# EAGLE design D2D-TOP (EAGLE 9.6.1)
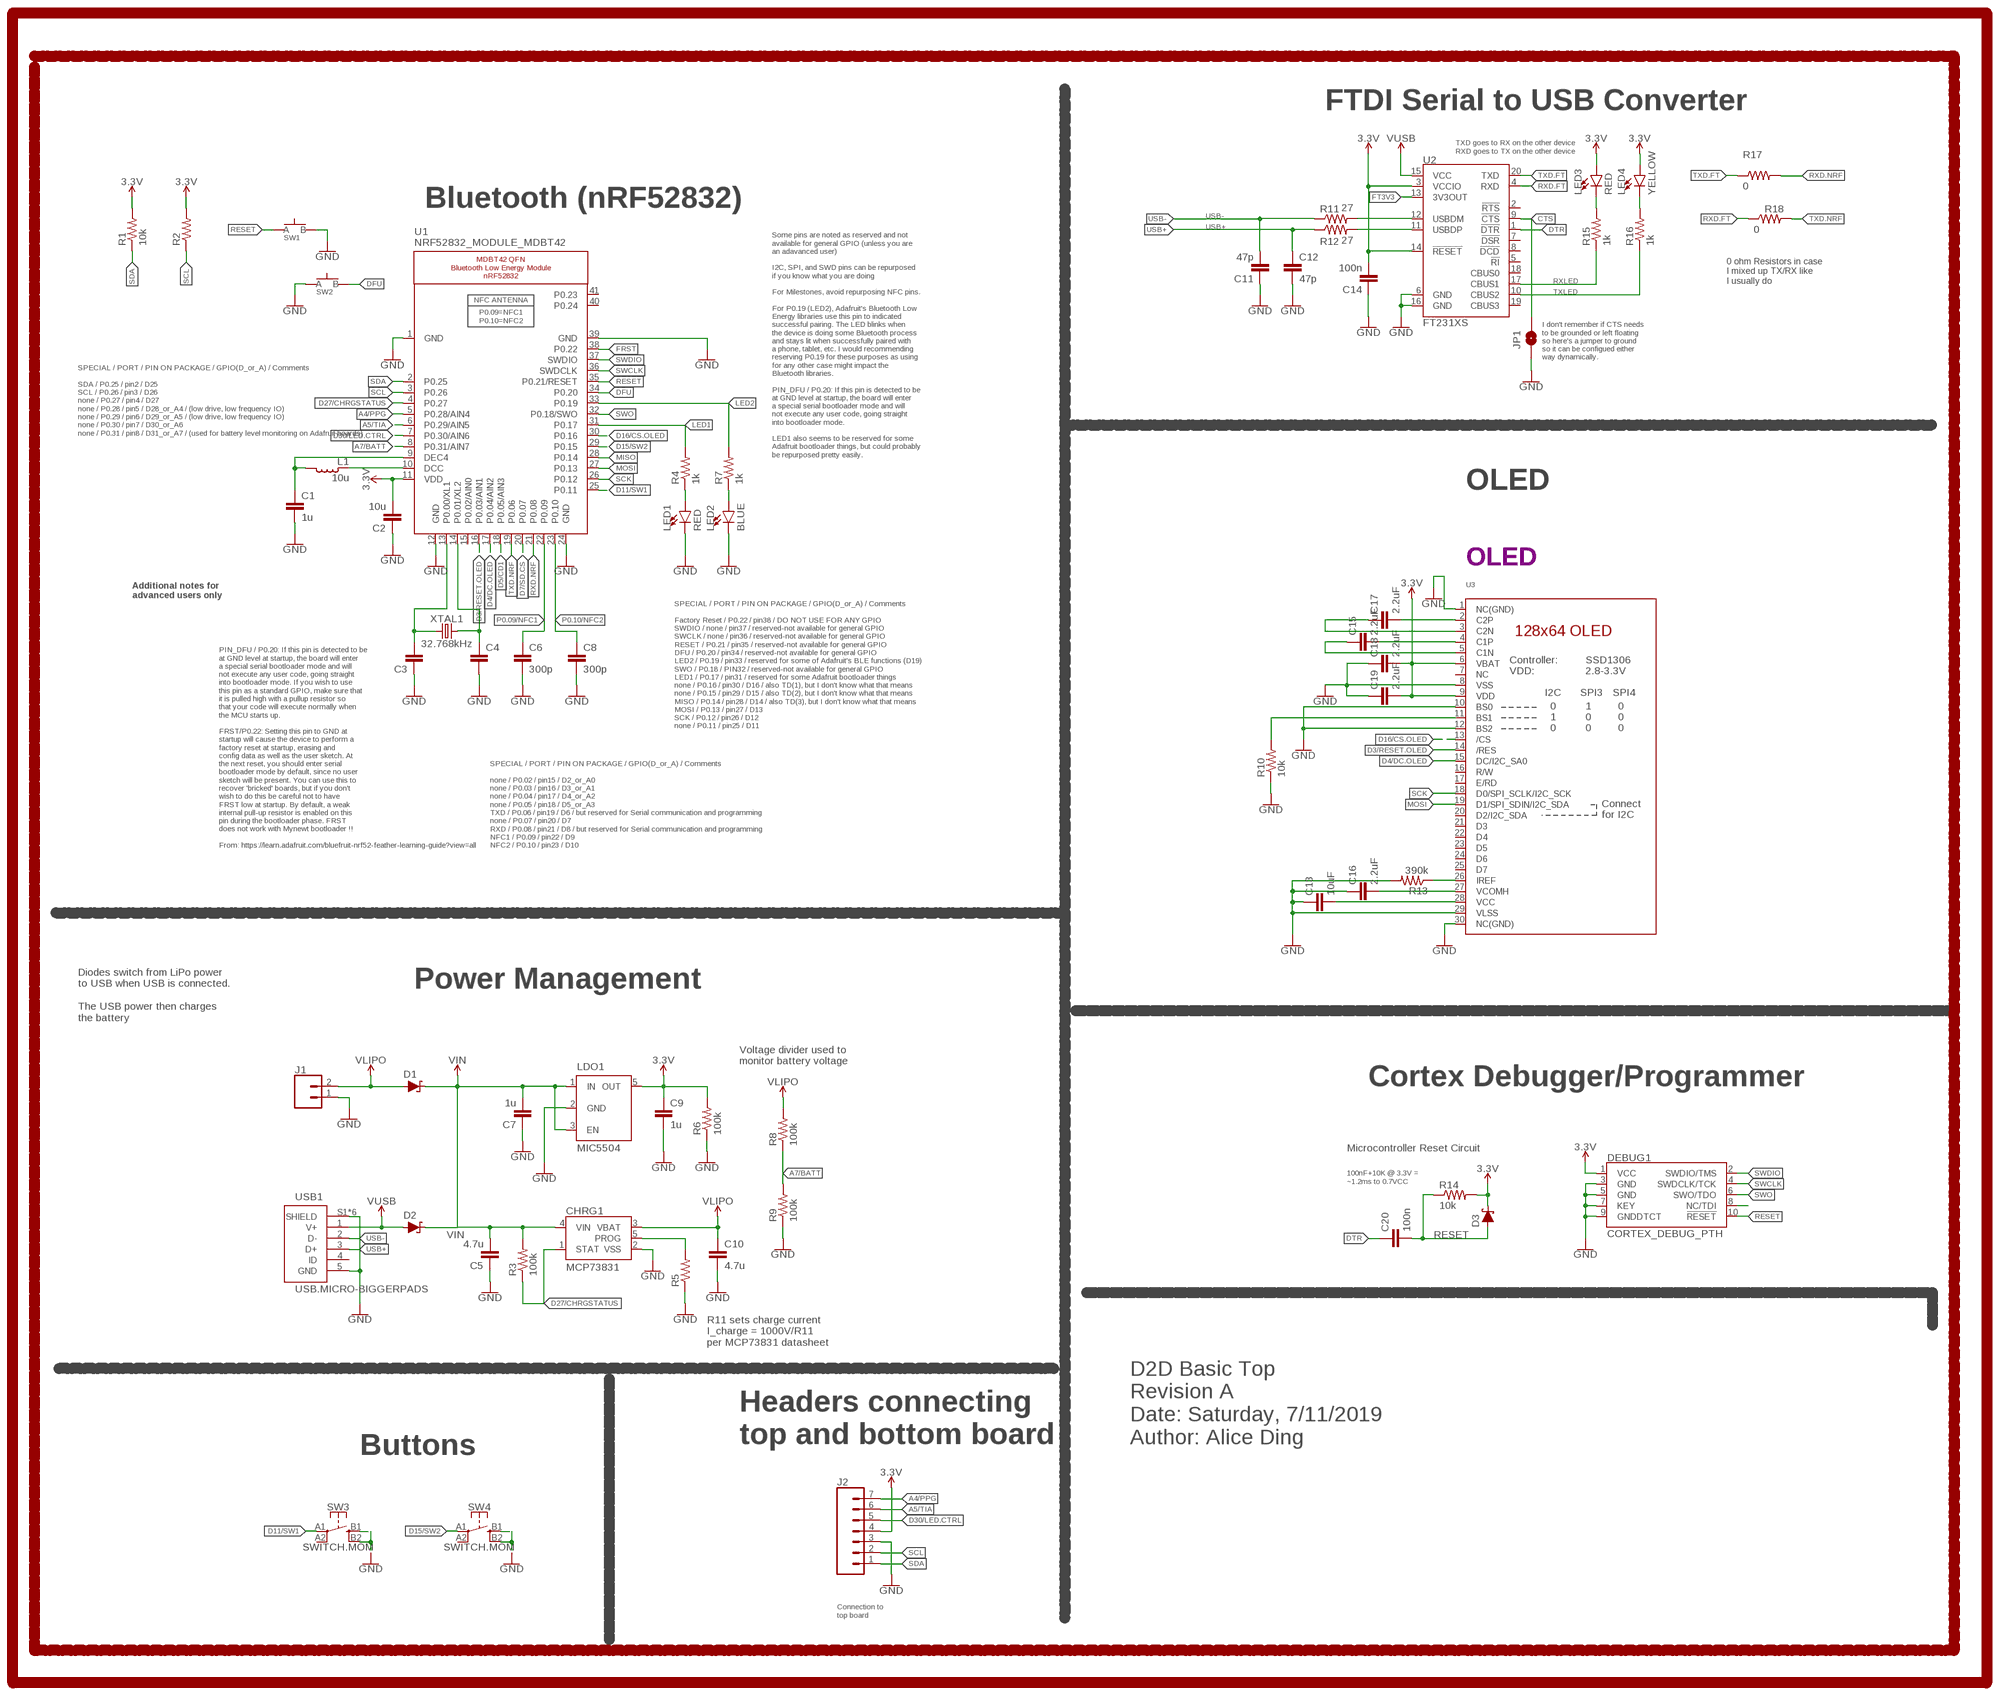
[diagram p0: schematic, sheet 1]

## Parts
C1  1u  CAPACITOR0603  [C0603]
C2  10u  CAPACITOR0805  [C0805]
C3  CAPACITOR0603  [C0603]
C4  CAPACITOR0603  [C0603]
C5  4.7u  CAPACITOR0603  [C0603]
C6  300p  CAPACITOR0603  [C0603]
C7  1u  CAPACITOR0603  [C0603]
C8  300p  CAPACITOR0603  [C0603]
C9  1u  CAPACITOR0603  [C0603]
C10  4.7u  CAPACITOR0603  [C0603]
C11  47p  CAPACITOR0603  [C0603]
C12  47p  CAPACITOR0603  [C0603]
C13  10uF  CAPACITOR0603  [C0603]
C14  100n  CAPACITOR0603  [C0603]
C15  2.2uF  CAPACITOR0402  [C0402]
C16  2.2uF  CAPACITOR0402  [C0402]
C17  2.2uF  CAPACITOR0402  [C0402]
C18  2.2uF  CAPACITOR0402  [C0402]
C19  2.2uF  CAPACITOR0402  [C0402]
C20  100n  CAPACITOR0603  [C0603]
CHRG1  MCP73831  [SOT23-5]
D1  SCHOTTKY-USC  [USC]
D2  SCHOTTKY-USC  [USC]
D3  SCHOTTKY-USC  [USC]
DEBUG1  CORTEX_DEBUG_PTH  [2X5-PTH-1.27MM]
J1  CONN_02  [1X02]
J2  CONN_07-1.27MM  [1X07_1.27MM]
JP1  JUMPER-SMT_2_NO_SILK  [SMT-JUMPER_2_NO_SILK]
L1  10u  INDUCTOR0603  [L0603]
LDO1  MIC5504  [SOT23-5]
LED1  RED  LED0603  [LED-0603]
LED2  BLUE  LED0603  [LED-0603]
LED3  RED  LED0603  [LED-0603]
LED4  YELLOW  LED0603  [LED-0603]
R1  10k  RESISTOR0603  [R0603]
R2  RESISTOR0603  [R0603]
R3  100k  RESISTOR0603  [R0603]
R4  1k  RESISTOR0603  [R0603]
R5  RESISTOR0603  [R0603]
R6  100k  RESISTOR0603  [R0603]
R7  1k  RESISTOR0603  [R0603]
R8  100k  RESISTOR0603  [R0603]
R9  100k  RESISTOR0603  [R0603]
R10  10k  RESISTOR0603  [R0603]
R11  27  RESISTOR0603  [R0603]
R12  27  RESISTOR0603  [R0603]
R13  390k  RESISTOR0603  [R0603]
R14  10k  RESISTOR0603  [R0603]
R15  1k  RESISTOR0603  [R0603]
R16  1k  RESISTOR0603  [R0603]
R17  0  RESISTOR0603  [R0603]
R18  0  RESISTOR0603  [R0603]
SW1  SPST-PTS830GG140-COPY.1-3  [BUTTON-GULLWING]
SW2  SPST-PTS830GG140-COPY.1-3  [BUTTON-GULLWING]
SW3  SWITCH.MOM  [TACTILE_SWITCH_SMD_6.2MM_TALL]
SW4  SWITCH.MOM  [TACTILE_SWITCH_SMD_6.2MM_TALL]
U1  NRF52832_MODULE_MDBT42  [BLE_MODULE_RAYTAC_MDBT42]
U2  FT231XS  [SSOP20_L]
U3  DISP_OLED_UG-2864HSWEG01-NO-WRAPAROUND  [UG-2864HSWEG01_0.96IN_NO-WRAPAROUND]
USB1  USB.MICRO-BIGGERPADS  [USB-MICRO-01.BIGGERPADS]
XTAL1  32.768kHz  CRYSTALECS-.327-12.5-12-C-TR  [2-SMD.NOLEAD.2.0MMTO1.2MM]

## Nets
3.3V: C2.2 C9.1 C14.2 C18.2 C19.2 D3.-(C) DEBUG1.1(VCC) J2.4 LDO1.5(OUT) LED3.A LED4.A R1.2 R2.2 R6.2 R14.2 U1.11(VDD) U2.3(VCCIO) U2.14(!RESET) U3.6(VBAT) U3.9(VDD)
A4/PPG: J2.7 U1.5(P0.28/AIN4)
A5/TIA: J2.6 U1.6(P0.29/AIN5)
A7/BATT: R8.1 R9.2 U1.8(P0.31/AIN7)
CTS: JP1.2 U2.9(!CTS)
D3/RESET.OLED: U1.16(P0.03/AIN1) U3.14(/RES)
D4/DC.OLED: U1.17(P0.04/AIN2) U3.15(DC/I2C_SA0)
D5/CD1: U1.18(P0.05/AIN3)
D7/SD.CS: U1.20(P0.07)
D11/SW1: SW3.A1 U1.25(P0.11)
D15/SW2: SW4.A1 U1.29(P0.15)
D16/CS.OLED: U1.30(P0.16) U3.13(/CS)
D27/CHRGSTATUS: CHRG1.1(STAT) R3.1 U1.4(P0.27)
D30/LED.CTRL: J2.5 U1.7(P0.30/AIN6)
DFU: SW2.3(B) U1.34(P0.20)
DTR: C20.1 U2.1(!DTR)
FRST: U1.38(P0.22)
FT3V3: U2.13(3V3OUT)
GND: C1.2 C2.1 C3.1 C4.2 C5.1 C6.2 C7.1 C8.2 C9.2 C10.2 C11.1 C12.2 C13.1 C14.1 C16.1 C18.1 C19.1 CHRG1.2(VSS) DEBUG1.3(GND) DEBUG1.5(GND) DEBUG1.7(KEY) DEBUG1.9(GNDDTCT) J1.1 J2.3 JP1.1 LDO1.2(GND) LED1.C LED2.C R5.1 R6.1 R9.1 R10.1 R13.2 SW1.3(B) SW2.1(A) SW3.B1 SW3.B2 SW4.B1 SW4.B2 U1.1(GND) U1.12(GND) U1.24(GND) U1.39(GND) U2.6(GND) U2.16(GND) U3.1(NC(GND)) U3.8(VSS) U3.10(BS0) U3.12(BS2) U3.29(VLSS) U3.30(NC(GND)) USB1.5(GND) USB1.S1(SHIELD) USB1.S2(SHIELD) USB1.S3(SHIELD) USB1.S4(SHIELD) USB1.S5(SHIELD) USB1.S6(SHIELD)
LED1: R4.2 U1.31(P0.17)
LED2: R7.2 U1.33(P0.19)
MISO: U1.28(P0.14)
MOSI: U1.27(P0.13) U3.19(D1/SPI_SDIN/I2C_SDA)
N$1: R10.2 U3.11(BS1)
N$2: R13.1 U3.26(IREF)
N$3: C17.2 U3.2(C2P)
N$4: C3.2 U1.13(P0.00/XL1) XTAL1.P$1
N$5: C17.1 U3.3(C2N)
N$6: C4.1 U1.14(P0.01/XL2) XTAL1.P$2
N$7: C15.2 U3.4(C1P)
N$8: C15.1 U3.5(C1N)
N$9: LED1.A R4.1
N$10: LED2.A R7.1
N$11: L1.1 U1.10(DCC)
N$12: C1.1 L1.2 U1.9(DEC4)
N$13: C13.2 U3.28(VCC)
N$14: DEBUG1.8(NC/TDI)
N$15: C16.2 U3.27(VCOMH)
N$16: CHRG1.5(PROG) R5.2
N$23: R11.2 U2.12(USBDM)
N$24: R12.2 U2.11(USBDP)
N$25: LED3.C R15.2
N$26: LED4.C R16.2
P0.09/NFC1: C6.1 U1.22(P0.09)
P0.10/NFC2: C8.1 U1.23(P0.10)
RESET: C20.2 D3.+(A) DEBUG1.10(!RESET) R14.1 SW1.1(A) U1.35(P0.21/RESET)
RXD.FT: R18.1 U2.4(RXD)
RXD.NRF: R17.2 U1.21(P0.08)
RXLED: R15.1 U2.17(CBUS1)
SCK: U1.26(P0.12) U3.18(D0/SPI_SCLK/I2C_SCK)
SCL: J2.2 R2.1 U1.3(P0.26)
SDA: J2.1 R1.1 U1.2(P0.25)
SWCLK: DEBUG1.4(SWDCLK/TCK) U1.36(SWDCLK)
SWDIO: DEBUG1.2(SWDIO/TMS) U1.37(SWDIO)
SWO: DEBUG1.6(SWO/TDO) U1.32(P0.18/SWO)
TXD.FT: R17.1 U2.20(TXD)
TXD.NRF: R18.2 U1.19(P0.06)
TXLED: R16.1 U2.10(CBUS2)
USB+: C12.1 R12.1 USB1.3(D+)
USB-: C11.2 R11.1 USB1.2(D-)
V_USB: D2.+(A) U2.15(VCC) USB1.1(V+) ; supply symbol labelled VUSB
VIN: C5.2 C7.2 CHRG1.4(VIN) D1.-(C) D2.-(C) LDO1.1(IN) LDO1.3(EN) R3.2
VLIPO: C10.1 CHRG1.3(VBAT) D1.+(A) J1.2 R8.2
Unconnected: SW3.A2 SW4.A2 U1.15(P0.02/AIN0) U1.40(P0.24) U1.41(P0.23) U2.2(!RTS) U2.5(!RI) U2.7(!DSR) U2.8(!DCD) U2.18(CBUS0) U2.19(CBUS3) U3.7(NC) U3.16(R/W) U3.17(E/RD) U3.20(D2/I2C_SDA) U3.21(D3) U3.22(D4) U3.23(D5) U3.24(D6) U3.25(D7) USB1.4(ID)

## Notes on the sheet
- FTDI Serial to USB Converter
- TXD goes to RX on the other device
  RXD goes to TX on the other device
- Bluetooth (nRF52832)
- 0 ohm Resistors in case
  I mixed up TX/RX like
  I usually do
- I don't remember if CTS needs
  to be grounded or left floating
  so here's a jumper to ground
  so it can be configued either
  way dynamically.
- SPECIAL / PORT / PIN ON PACKAGE / GPIO(D_or_A) / Comments
  
  SDA / P0.25 / pin2 / D25
  SCL / P0.26 / pin3 / D26
  none / P0.27 / pin4 / D27
  none / P0.28 / pin5 / D28_or_A4 / (low drive, low frequency IO)
  none / P0.29 / pin6 / D29_or_A5 / (low drive, low frequency IO)
  none / P0.30 / pin7 / D30_or_A6
  none / P0.31 / pin8 / D31_or_A7 / (used for battery level monitoring on Adafruit boards)
- Some pins are noted as reserved and not
  available for general GPIO (unless you are
  an adavanced user)
  
  I2C, SPI, and SWD pins can be repurposed
  if you know what you are doing
  
  For Milestones, avoid repurposing NFC pins.
  
  For P0.19 (LED2), Adafruit's Bluetooth Low
  Energy libraries use this pin to indicated
  successful pairing. The LED blinks when
  the device is doing some Bluetooth process
  and stays lit when successfully paired with
  a phone, tablet, etc. I would recommending
  reserving P0.19 for these purposes as using
  for any other case might impact the
  Bluetooth libraries.
  
  PIN_DFU / P0.20: If this pin is detected to be
  at GND level at startup, the board will enter
  a special serial bootloader mode and will
  not execute any user code, going straight
  into bootloader mode.
  
  LED1 also seems to be reserved for some
  Adafruit bootloader things, but could probably
  be repurposed pretty easily.
- OLED
- OLED
- Additional notes for
  advanced users only
- SPECIAL / PORT / PIN ON PACKAGE / GPIO(D_or_A) / Comments
  
  Factory Reset / P0.22 / pin38 / DO NOT USE FOR ANY GPIO
  SWDIO / none / pin37 / reserved-not available for general GPIO
  SWCLK / none / pin36 / reserved-not available for general GPIO
  RESET / P0.21 / pin35 / reserved-not available for general GPIO
  DFU / P0.20 / pin34 / reserved-not available for general GPIO
  LED2 / P0.19 / pin33 / reserved for some of Adafruit's BLE functions (D19)
  SWO / P0.18 / PIN32 / reserved-not available for general GPIO
  LED1 / P0.17 / pin31 / reserved for some Adafruit bootloader things
  none / P0.16 / pin30 / D16 / also TD(1), but I don't know what that means
  none / P0.15 / pin29 / D15 / also TD(2), but I don't know what that means
  MISO / P0.14 / pin28 / D14 / also TD(3), but I don't know what that means
  MOSI / P0.13 / pin27 / D13
  SCK / P0.12 / pin26 / D12
  none / P0.11 / pin25 / D11
- PIN_DFU / P0.20: If this pin is detected to be
  at GND level at startup, the board will enter
  a special serial bootloader mode and will
  not execute any user code, going straight
  into bootloader mode. If you wish to use
  this pin as a standard GPIO, make sure that
  it is pulled high with a pullup resistor so
  that your code will execute normally when
  the MCU starts up.
  
  FRST/P0.22: Setting this pin to GND at
  startup will cause the device to perform a
  factory reset at startup, erasing and
  config data as well as the user sketch. At
  the next reset, you should enter serial
  bootloader mode by default, since no user
  sketch will be present. You can use this to
  recover 'bricked' boards, but if you don't
  wish to do this be careful not to have
  FRST low at startup. By default, a weak
  internal pull-up resistor is enabled on this
  pin during the bootloader phase. FRST
  does not work with Mynewt bootloader !!
  
  From: https://learn.adafruit.com/bluefruit-nrf52-feather-learning-guide?view=all
- SPECIAL / PORT / PIN ON PACKAGE / GPIO(D_or_A) / Comments
  
  none / P0.02 / pin15 / D2_or_A0
  none / P0.03 / pin16 / D3_or_A1
  none / P0.04 / pin17 / D4_or_A2
  none / P0.05 / pin18 / D5_or_A3
  TXD / P0.06 / pin19 / D6 / but reserved for Serial communication and programming
  none / P0.07 / pin20 / D7
  RXD / P0.08 / pin21 / D8 / but reserved for Serial communication and programming
  NFC1 / P0.09 / pin22 / D9
  NFC2 / P0.10 / pin23 / D10
- Power Management
- Diodes switch from LiPo power 
  to USB when USB is connected.
  
  The USB power then charges 
  the battery
- Voltage divider used to 
  monitor battery voltage
- Cortex Debugger/Programmer
- Microcontroller Reset Circuit
- 100nF+10K @ 3.3V =
  ~1.2ms to 0.7VCC
- R11 sets charge current
  I_charge = 1000V/R11
  per MCP73831 datasheet
- Headers connecting
  top and bottom board
- D2D Basic Top
  Revision A
  Date: Saturday, 7/11/2019
  Author: Alice Ding
- Buttons
- Connection to 
  top board

## Library data of the parts
C1-C20 = LinnesLab-Passives:CAPACITOR
CHRG1 = LinnesLab-Power:MCP73831: MCP73831T Li-Ion, Li-Pol Controller Miniature single cell, fully integrated Li-Ion, Li-polymer charge management controller Datasheet <http://ww1.microchip.com/downloads/en/DeviceDoc/20001984g.pdf> SparkFun Products: SparkFun ESP32 Thing <https://www.sparkfun.com/products/13907> SparkFun 9DoF Razor IMU M0 <https://www.sparkfun.com/products/14001>; PROD_ID: IC-09995
D1-D3 = LinnesLab-DiscreteSemi:SCHOTTKY: Schottky diode A Schottky diode is a semiconductor diode which has a low forward voltage drop and a very fast switching action. Example: Digi-Key Part Number: RB161MM-20CT-ND
DEBUG1 = LinnesLab-Connectors:CORTEX_DEBUG: Cortex Debug Connector - 10 pin Supports JTAG debug, Serial Wire debug, and Serial Wire Viewer. PTH and SMD connector options available. General Connector Information <http://infocenter.arm.com/help/topic/com.arm.doc.faqs/attached/13634/cortex_debug_connectors.pdf> Products: PTH Connector <http://www.digikey.com/product-detail/en/cnc-tech/3220-10-0100-00/1175-1627-ND/3883661> -via Digi-Key SparkFun PSoc <https://www.sparkfun.com/products/13229> SparkFun T <https://www.sparkfun.com/products/13810>
J1 = LinnesLab-Connectors:CONN_02: Multi connection point. Often used as Generic Header-pin footprint for 0.1 inch spaced/style header connections On any of the 0.1 inch spaced packages, you can populate with these: Break Away Headers - Straight <https://www.sparkfun.com/products/116> (PRT-00116) Break Away Male Headers - Right Angle <https://www.sparkfun.com/products/553> (PRT-00553) Female Headers <https://www.sparkfun.com/products/115> (PRT-00115) Break Away Headers - Machine Pin <https://www.sparkfun.com/products/117> (PRT-00117) Break Away Female Headers - Swiss Machine Pin <https://www.sparkfun.com/products/743> (PRT-00743) For SCREWTERMINALS and SPRING TERMINALS visit here: Screw Terimnals on SparkFun.com <https://www.sparkfun.com/search/results?term=Screw+Terminals> (5mm/3.5mm/2.54mm spacing) This device is also useful as a general connection point to wire up your design to another part of your project. Our various solder wires solder well into these plated through hole pads. Hook-Up Wire - Assortment (Stranded, 22 AWG) <https://www.sparkfun.com/products/11375> (PRT-11375) Hook-Up Wire - Assortment (Solid Core, 22 AWG) <https://www.sparkfun.com/products/11367> (PRT-11367) View the entire wire category on our website here <https://www.sparkfun.com/categories/141> Special notes: Molex polarized connector foot print use with: PRT-08233 with associated crimp pins and housings. 2.54_SCREWTERM for use with PRT-10571. 3.5mm Screw Terminal footprints for PRT-08084 5mm Screw Terminal footprints for use with PRT-08432
J2 = LinnesLab-Connectors:CONN_07: Multi connection point. Often used as Generic Header-pin footprint for 0.1 inch spaced/style header connections On any of the 0.1 inch spaced packages, you can populate with these: Break Away Headers - Straight <https://www.sparkfun.com/products/116> (PRT-00116) Break Away Male Headers - Right Angle <https://www.sparkfun.com/products/553> (PRT-00553) Female Headers <https://www.sparkfun.com/products/115> (PRT-00115) Break Away Headers - Machine Pin <https://www.sparkfun.com/products/117> (PRT-00117) Break Away Female Headers - Swiss Machine Pin <https://www.sparkfun.com/products/743> (PRT-00743) For SCREWTERMINALS and SPRING TERMINALS visit here: Screw Terimnals on SparkFun.com <https://www.sparkfun.com/search/results?term=Screw+Terminals> (5mm/3.5mm/2.54mm spacing) This device is also useful as a general connection point to wire up your design to another part of your project. Our various solder wires solder well into these plated through hole pads. Hook-Up Wire - Assortment (Stranded, 22 AWG) <https://www.sparkfun.com/products/11375> (PRT-11375) Hook-Up Wire - Assortment (Solid Core, 22 AWG) <https://www.sparkfun.com/products/11367> (PRT-11367) View the entire wire category on our website here <https://www.sparkfun.com/categories/141> Special notes: Molex polarized connector foot print use with SKU : PRT-08231 with associated crimp pins and housings. 1MM SMD Version SKU: PRT-10208 NOTES ON THE VARIANTS LOCK and LOCK_LONGPADS... This footprint was designed to help hold the alignment of a through-hole component (i.e. 6-pin header) while soldering it into place. You may notice that each hole has been shifted either up or down by 0.005 of an inch from it's more standard position (which is a perfectly straight line). This slight alteration caused the pins (the squares in the middle) to touch the edges of the holes. Because they are alternating, it causes a "brace" to hold the component in place. 0.005 has proven to be the perfect amount of "off-center" position when using our standard breakaway headers. Although looks a little odd when you look at the bare footprint, once you have a header in there, the alteration is very hard to notice. Also,if you push a header all the way into place, it is covered up entirely on the bottom side.
JP1 = LinnesLab-Switches:JUMPER-SMT_2_NO: Normally open jumper This jumper has two pads in close proximity to each other. Apply solder to close the connection. Round pads are easier to solder for beginners, but are a lot larger. SparkFun Product that uses the round pads: SparkFun EL Sequencer <https://www.sparkfun.com/products/12781>
L1 = LinnesLab-Passives:INDUCTOR
LDO1 = LinnesLab-Power:MIC5504: MIC5504 Voltage Regulator Output Voltages: 1.0V to 3.3V Input Voltages: 2.5V to 5.5V Link to Datasheet http://ww1.microchip.com/downloads/en/DeviceDoc/MIC550X.pdf
LED1-LED4 = LinnesLab-LED:LED: LED (Generic) Standard schematic elements and footprints for 5mm, 3mm, 1206, and 0603 sized LEDs. Generic LEDs with no color specified. LTST-C190KGKT: arrow indicates cathode
R1-R18 = LinnesLab-Passives:RESISTOR
SW1 SW2 = LinnesLab-Switches:SPST-PTS830GG140-COPY
SW3 SW4 = LinnesLab-Switches:SWITCH.MOM: PTS645SM43SMTR92 LFS
U1 = LinnesLab-Microcontrollers:NRF52832_MODULE_MDBT42: MDBT42 - BLE Module (nRF52832 QFN) VDD: 1.7-3.6V
U2 = LinnesLab-DigitalIC:FT231X: FTDI FT231X Full Speed USB to Full-handshake UART This USB2.0 Full Speed IC offers a compact bridge to full handshake UART interfaces. The device is a UART, capable of operating up to 3MBaud, with low power consumption (8mA). The FT231X includes the complete FT-X series feature set and enables USB to be added into a system design quickly and easily over a UART interface. Datasheet <http://cdn.sparkfun.com/datasheets/Components/General%20IC/DS_FT231X.pdf>; DIGIKEY: 768-1156-5-ND; MFN: FT231XS-U
U3 = LinnesLab-Displays:DISP_OLED_UG-2864HSWEG01: UG-2864HSWEG01 OLED display Both 1.3" and 0.96" models share the same FPC tab footprint, only the screen dimensions vary.
USB1 = LinnesLab-Connectors:USB.MICRO: DigiKey PN: 609-4613-1-ND
XTAL1 = LinnesLab-Clocks:CRYSTAL; DIGIKEY: XC2288CT-ND; FREQ: 32.7680KHZ; LOAD_CAP: 12.5pF

## Board
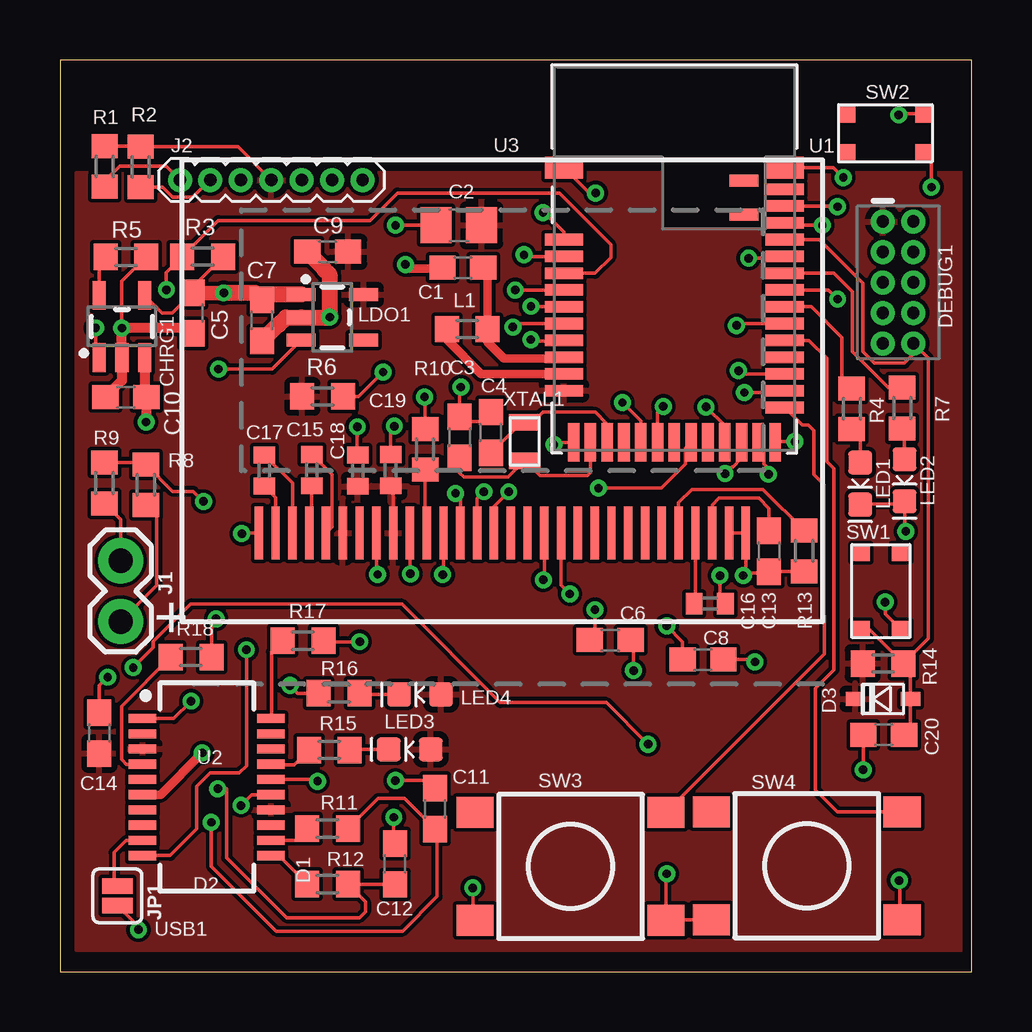
[diagram p1: board, top side]
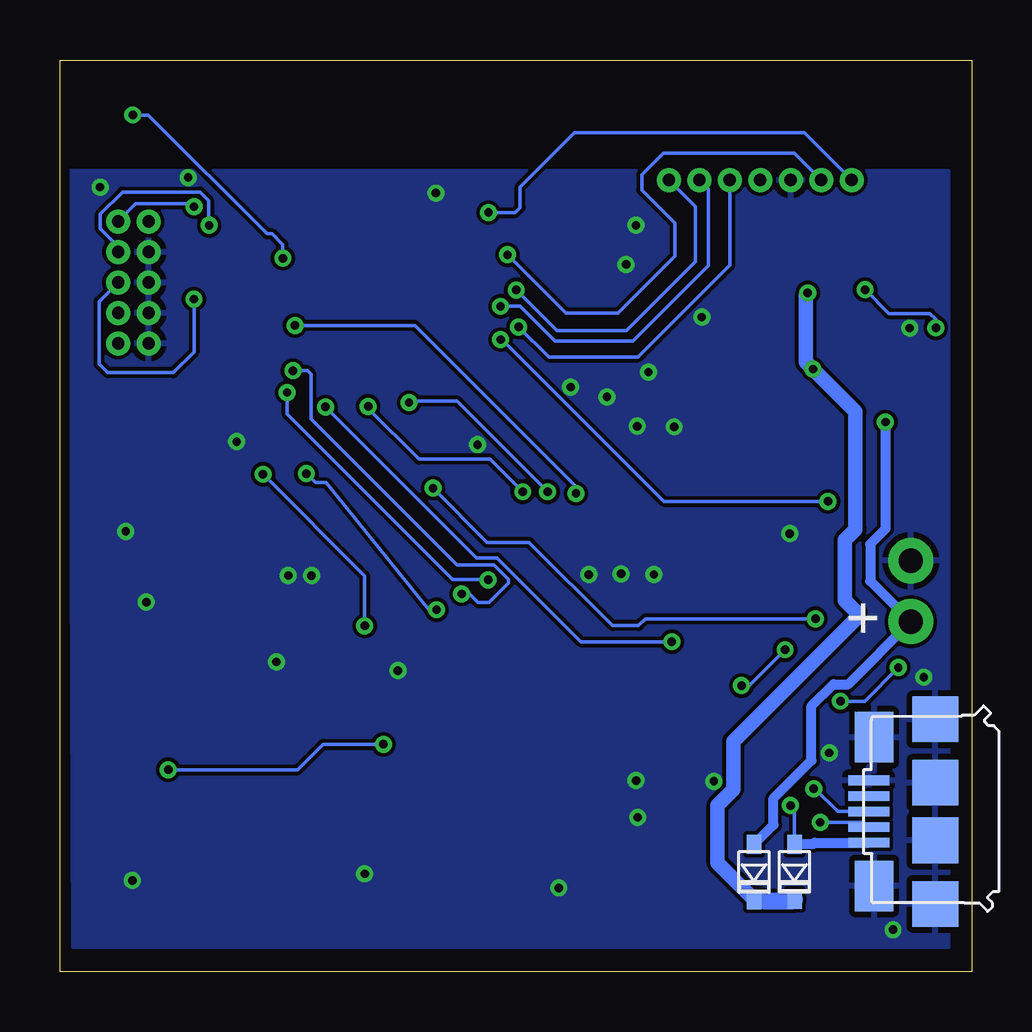
[diagram p2: board, bottom side, seen from below]

Size 38 x 38 mm. Coordinates in mm from the lower left corner, seen from the top.
Outline: 0,0 38,0 38,38 0,38 0,0
Copper layers (1*16): Top 0.0356mm / dielectric 1.5011mm / Bottom 0.0356mm
Design rules "LaenPCBOrder": minimum track width 6mil, minimum drill 13mil, track to track 6mil, track to pad 6mil, pad to pad 6mil, via to via 6mil, smd to smd 6mil, copper to edge 15mil, drill to drill 6mil, minimum pad ring 7mil, minimum via ring 7mil, stop-mask expansion 3mil, vias tented up to drill 0mil, thermal gap 10mil

### Footprints (pad centres in the part's own frame; a part is rotated, then mirrored left to right if it is on the bottom)
C0603 = smd 1.1 x 1: 1 -0.85,0; 2 0.85,0
C0805 = smd 1.3 x 1.5: 1 -0.95,0; 2 0.95,0
C0402 = smd 0.7 x 0.9: 1 -0.65,0; 2 0.65,0
SOT23-5 = smd 0.55 x 1.2: 1 -0.95,-1.3; 2 0,-1.3; 3 0.95,-1.3; 4 0.95,1.3; 5 -0.95,1.3
USC = smd 0.8 x 0.6: + -1.15,0; - 1.15,0
2X5-PTH-1.27MM = drill 0.508 pad 1: 1 -2.54,-0.635; 2 -2.54,0.635; 3 -1.27,-0.635; 4 -1.27,0.635; 5 0,-0.635; 6 0,0.635; 7 1.27,-0.635; 8 1.27,0.635; 9 2.54,-0.635; 10 2.54,0.635
1X02 = drill 1.016 pad 1.88: 1 0,0; 2 2.54,0
1X07_1.27MM = drill 0.508 pad 1: 1 0,0; 2 1.27,0; 3 2.54,0; 4 3.81,0; 5 5.08,0; 6 6.35,0; 7 7.62,0
SMT-JUMPER_2_NO_SILK = smd 0.635 x 1.27: 1 -0.406,0; 2 0.406,0
L0603 = smd 1 x 1.1: 1 -0.85,0; 2 0.85,0
LED-0603 = smd 1 x 1: A -0.877,0; C 0.877,0
R0603 = smd 1 x 1.1: 1 -0.85,0; 2 0.85,0
BUTTON-GULLWING = smd 0.7 x 0.75: 1 -1.6,0.825; 2 1.6,0.825; 3 -1.6,-0.825; 4 1.6,-0.825
TACTILE_SWITCH_SMD_6.2MM_TALL = smd 1.55 x 1.3: A1 -3.975,-2.25; A2 3.975,-2.25; B1 -3.975,2.25; B2 3.975,2.25
BLE_MODULE_RAYTAC_MDBT42 = smd 1.6 x 0.9: 1 -4.6,3.8; 39 4.6,3.8 | smd 1.6 x 0.48: 2 -4.6,0.8; 3 -4.6,0.1; 4 -4.6,-0.6; 5 -4.6,-1.3; 6 -4.6,-2; 7 -4.6,-2.7; 8 -4.6,-3.4; 9 -4.6,-4.1; 10 -4.6,-4.8; 11 -4.6,-5.5; 25 4.6,-6.2; 26 4.6,-5.5; 27 4.6,-4.8; 28 4.6,-4.1; 29 4.6,-3.4; 30 4.6,-2.7; 31 4.6,-2; 32 4.6,-1.3; 33 4.6,-0.6; 34 4.6,0.1; 35 4.6,0.8; 36 4.6,1.5; 37 4.6,2.2; 38 4.6,2.9 | smd 0.48 x 1.6: 12 -4.2,-7.65; 13 -3.5,-7.65; 14 -2.8,-7.65; 15 -2.1,-7.65; 16 -1.4,-7.65; 17 -0.7,-7.65; 18 0,-7.65; 19 0.7,-7.65; 20 1.4,-7.65; 21 2.1,-7.65; 22 2.8,-7.65; 23 3.5,-7.65; 24 4.2,-7.65 | smd 1.2 x 0.5: 40 2.9,3.25; 41 2.9,1.85
SSOP20_L = smd 0.381 x 1.143: 1 -2.857,-2.68; 2 -2.223,-2.68; 3 -1.587,-2.68; 4 -0.953,-2.68; 5 -0.318,-2.68; 6 0.318,-2.68; 7 0.953,-2.68; 8 1.587,-2.68; 9 2.223,-2.68; 10 2.857,-2.68; 11 2.857,2.68; 12 2.223,2.68; 13 1.587,2.68; 14 0.953,2.68; 15 0.318,2.68; 16 -0.318,2.68; 17 -0.953,2.68; 18 -1.587,2.68; 19 -2.223,2.68; 20 -2.857,2.68
UG-2864HSWEG01_0.96IN_NO-WRAPAROUND = smd 0.35 x 2.2: 1 -10.15,-1.2; 2 -9.45,-1.2; 3 -8.75,-1.2; 4 -8.05,-1.2; 5 -7.35,-1.2; 6 -6.65,-1.2; 7 -5.95,-1.2; 8 -5.25,-1.2; 9 -4.55,-1.2; 10 -3.85,-1.2; 11 -3.15,-1.2; 12 -2.45,-1.2; 13 -1.75,-1.2; 14 -1.05,-1.2; 15 -0.35,-1.2; 16 0.35,-1.2; 17 1.05,-1.2; 18 1.75,-1.2; 19 2.45,-1.2; 20 3.15,-1.2; 21 3.85,-1.2; 22 4.55,-1.2; 23 5.25,-1.2; 24 5.95,-1.2; 25 6.65,-1.2; 26 7.35,-1.2; 27 8.05,-1.2; 28 8.75,-1.2; 29 9.45,-1.2; 30 10.15,-1.2
USB-MICRO-01.BIGGERPADS = smd 0.4 x 1.7: 1 -1.3,1.505; 2 -0.65,1.505; 3 0,1.505; 4 0.65,1.505; 5 1.3,1.505 | smd 1.9 x 1.9: S1 -3.85,-1.27; S2 -1.2,-1.27; S3 1.2,-1.27; S4 3.85,-1.27 | smd 2.1 x 1.6: S5 -3.1,1.28; S6 3.1,1.28
2-SMD.NOLEAD.2.0MMTO1.2MM = smd 0.7 x 1.3: P$1 -0.8,0; P$2 0.8,0

### Placement (x,y rotation side)
C1  16.8,29.34 180 top
C2  16.62,31.1 0 top
C3  16.66,22.27 270 top
C4  17.97,22.47 90 top
C5  5.53,27.45 90 top
C6  22.94,13.81 0 top
C7  8.42,27.15 90 top
C8  26.81,13 0 top
C9  11.16,30.01 180 top
C10  2.75,23.95 180 top
C11  15.63,6.79 270 top
C12  13.97,4.49 90 top
C13  29.56,17.52 90 top
C14  1.64,9.94 270 top
C15  10.5,20.9 270 top
C16  27.09,15.34 180 top
C17  8.52,20.89 270 top
C18  12.41,20.88 270 top
C19  13.78,20.9 270 top
C20  34.34,9.87 0 top
CHRG1  2.58,26.89 0 top
D1  9.07,4.15 270 bottom
D2  7.38,4.16 270 bottom
D3  34.31,11.36 180 top
DEBUG1  34.94,28.73 270 top
J1  2.53,17.13 270 top
J2  5,33 0 top
JP1  2.39,3.16 90 top
L1  16.98,26.78 0 top
LDO1  11.35,27.27 270 top
LED1  33.36,20.34 270 top
LED2  35.21,20.48 270 top
LED3  14.58,9.26 180 top
LED4  15.01,11.55 180 top
R1  1.86,33.56 90 top
R2  3.37,33.54 90 top
R3  5.94,29.8 0 top
R4  33,23.46 90 top
R5  2.75,29.79 180 top
R6  10.95,23.98 180 top
R7  35.11,23.49 90 top
R8  3.58,20.29 270 top
R9  1.85,20.36 90 top
R10  15.22,21.77 270 top
R11  11.15,5.96 180 top
R12  11.15,3.65 180 top
R13  31.02,17.54 270 top
R14  34.32,12.84 180 top
R15  11.23,9.24 0 top
R16  11.63,11.6 0 top
R17  10.13,13.79 0 top
R18  5.46,13.11 0 top
SW1  34.22,15.86 90 top
SW2  34.41,34.95 180 top
SW3  21.28,4.38 180 top
SW4  31.13,4.41 180 top
U1  25.61,29.71 0 top
U2  6.12,7.69 270 top
U3  18.44,19.48 0 top
USB1  2.78,6.67 90 bottom
XTAL1  19.38,22.1 90 top

### Tracks (layer width: path | path; a pad name or v marks a point on that pad's centre or on a via)
3.3V
  Top 0.152: C19.2 13.89,20.14 U3.9 | R1.2 3.34,34.41 R2.2 7.42,34.39 J2.4
  pour Top: 37.62,33.31 0.68,33.31 0.68,0.88 37.62,0.88
A4/PPG  (via drill 0.35)
  Top 0.152: v18.98,28.41 U1.5
  Bottom 0.152: J2.7 11.51,31.89 11.51,29.6 14.39,26.72 17.29,26.72 v18.98,28.41
A5/TIA  (via drill 0.35)
  Top 0.152: U1.6 19.66,27.71 v19.64,27.73
  Bottom 0.152: J2.6 10.97,32.62 10.97,29.43 14.12,26.27 17.36,26.27 18.82,27.73 v19.64,27.73
A7/BATT  (via drill 0.35)
  Top 0.152: R9.2 3.51,21.21 R8.1 4.71,20.02 5.56,20.02 v5.98,19.6 | U1.8 20.98,26.28 19.69,26.28 v19.63,26.34
  Bottom 0.152: v19.63,26.34 19.62,26.33 19.55,26.33 12.82,19.6 v5.98,19.6
CTS
  Top 0.152: U2.9 2.75,5.47 2.25,4.97 2.25,3.7 JP1.2
D3/RESET.OLED  (via drill 0.35)
  Top 0.152: U3.14 17.39,19.72 v17.67,20 | v23.45,23.72 24.21,22.96 U1.16
  Bottom 0.152: v17.67,20 21.45,23.78 23.39,23.78 v23.45,23.72
D4/DC.OLED  (via drill 0.35)
  Top 0.152: U3.15 18.09,19.38 v18.71,20 | v25.15,23.56 25.12,23.53 25.12,23.51 24.91,23.3 U1.17
  Bottom 0.152: v18.71,20 20.07,21.36 23.04,21.36 25.15,23.48 v25.15,23.56
D11/SW1
  Top 0.152: U1.25 30.94,22.78 31.19,22.78 31.43,22.54 31.43,20.72 31.85,20.3 31.85,14.83 31.86,14.81 31.86,13.24 SW3.A1
D15/SW2
  Top 0.152: U1.29 31.22,26.31 31.97,25.57 31.97,21.27 32.27,20.97 32.27,12.58 31.49,11.8 31.49,7.57 32.4,6.66 SW4.A1
D16/CS.OLED  (via drill 0.35)
  Top 0.152: U3.13 16.69,19.73 v16.49,19.93 | v28.2,26.93 28.28,27.01 U1.30
  Bottom 0.152: v16.49,19.93 16.49,20.21 23.21,26.93 v28.2,26.93
D27/CHRGSTATUS  (via drill 0.35)
  Top 0.152: v4.44,28.42 4.44,29.14 R3.1 6.6,31.31 12.92,31.31 14.07,32.45 20.82,32.45 22.96,30.31 22.96,29.77 22.31,29.11 U1.4 | v1.49,26.83 1.49,25.73 CHRG1.1
  Bottom 0.152: v4.44,28.42 3.45,27.44 1.73,27.44 1.49,27.19 v1.49,26.83
D30/LED.CTRL  (via drill 0.35)
  Top 0.152: U1.7 19.01,27.01 v18.88,26.87
  Bottom 0.152: J2.5 10.08,29.45 13.91,25.62 17.62,25.62 v18.88,26.87
DFU  (via drill 0.35)
  Top 0.152: U1.34 30.14,29.74 v28.71,29.74 | v34.96,35.71 35.02,35.77 SW2.3
  Bottom 0.152: v28.71,29.74 28.71,30.31 29.16,30.76 29.37,30.76 34.32,35.71 v34.96,35.71
DTR  (via drill 0.35)
  Top 0.152: C20.1 v33.49,8.42 v33.48,8.41 | v3.05,12.68 3.88,13.51 3.88,13.75 5.45,15.31 14.25,15.31 18.35,11.21 22.68,11.21 22.78,11.21 v24.52,9.47 | v5.46,11.27 4.74,10.55 U2.1
  Bottom 0.152: v33.48,8.41 28.09,8.41 27.03,9.47 v24.52,9.47 | v3.05,12.68 4.46,11.27 v5.46,11.27
GND  (via drill 0.35)
  Top 0.152: U3.30 28.64,18.33 | U3.29 U3.30 | U3.1 7.61,18.28 v7.58,18.25 | C18.1 12.39,21.55 v12.39,22.71 | C19.1 13.79,22.49 13.94,22.65 v13.94,22.73 | U3.8 13.19,16.6 v13.24,16.55 | U3.10 14.59,16.6 v14.61,16.58 | U3.12 15.99,16.58 v15.95,16.55 | v15.2,23.95 15.22,23.92 R10.1 15.23,22.63 | R9.1 2.53,18.84 J1.1 | C4.2 17.58,22.93 16.85,22.93 C3.1 16.66,24.32 v16.71,24.37 | U1.12 20.69,22.06 v20.59,21.97 | R13.2 29.57,16.69 C13.1 29.51,16.62 28.59,16.62 | LED1.C 33.39,19.49 35.1,19.49 LED2.C 35.22,19.59 35.22,18.39 v35.26,18.35 | U1.24 29.84,22.09 v30.64,22.09 | SW1.3 34.4,14.91 v34.4,15.4 | SW2.1 36.33,33.8 v36.33,32.7 | C12.2 13.92,5.39 v13.92,6.43 | C11.1 15.31,7.96 v13.98,7.96 | C16.1 27.52,15.56 v27.52,16.51 | v25.3,4.07 25.26,4.04 SW3.B1 25.28,2.16 SW4.B2 | SW4.B1 35.01,2.25 35.01,3.77 v34.98,3.8 | C2.1 v14,31.11 v13.99,31.11 | U1.1 22.07,32.45 v22.33,32.45 | C14.1 1.64,11.92 v1.99,12.27 | JP1.1 3.27,1.87 v3.27,1.74 | U1.39 32.24,33.51 v32.65,33.1 | U3.30 28.59,16.62 | 28.59,16.62 v28.48,16.51 | C6.2 23.91,13.69 v23.91,12.54 | C8.2 28.88,13 v28.97,12.91 | SW3.B2 17.21,2.23 v17.21,3.49 | U2.16 10.66,8.01 v10.74,7.93 | R5.1 2.58,28.77 v2.58,26.82 | v13.47,24.99 12.45,23.98 R6.1
  Top 0.356: U2.6 4.2,7.37 v5.94,9.11 | C1.2 15.91,29.3 14.57,29.3 v14.4,29.47
  Top 0.406: v2.58,26.82 CHRG1.2 2.58,24.64 C10.2 | v2.58,26.82 | C5.1 5.32,26.82 v2.58,26.82
  Top 0.66: 11.23,27.27 LDO1.2 9.43,27.27 9.12,26.96 9.09,26.96 C7.1 | 11.23,27.27 v11.24,27.28 | C9.2 10.98,29.34 10.98,29.31 11.23,29.06 11.23,27.27
  pour Bottom: 37.6,33.38 0.94,33.38 0.94,1.01 37.46,1.01
LED1
  Top 0.152: R4.2 32.97,24.31 32.6,24.68 32.6,26.43 31.31,27.71 U1.31
LED2
  Top 0.152: R7.2 34.53,24.34 33.03,25.84 33.03,28.35 32.27,29.11 U1.33
MOSI  (via drill 0.35)
  Top 0.152: U3.19 20.89,16.11 v21.26,15.74 | v28.29,25.04 28.42,24.91 U1.27
  Bottom 0.152: v21.26,15.74 20.93,15.74 20.56,15.38 20.12,15.38 19.3,16.19 19.3,16.34 19.9,16.94 21.45,16.94 27.54,23.02 27.54,24.9 27.68,25.04 v28.29,25.04
N$1
  Top 0.152: R10.2 15.22,18.35 U3.11
N$2
  Top 0.152: R13.1 29.31,20.1 26.34,20.1 25.79,19.55 U3.26
N$3
  Top 0.152: C17.2 8.99,19.77 U3.2
N$4
  Top 0.152: C3.2 16.66,20.79 16.84,20.61 18.69,20.61 XTAL1.P$1 20,20.67 21.98,20.67 22.11,20.8 U1.13
N$5
  Top 0.152: C17.1 9.69,20.36 U3.3
N$6
  Top 0.152: C4.1 19.25,22.89 XTAL1.P$2 19.71,22.89 20.14,23.32 22.21,23.32 22.31,23.32 22.81,22.82 U1.14
N$7
  Top 0.152: C15.2 10.5,18.39 U3.4
N$8
  Top 0.152: C15.1 11.33,20.72 11.33,18.52 U3.5
N$9
  Top 0.152: LED1.A 33.36,22.26 R4.1
N$10
  Top 0.152: R7.1 35.21,22.54 LED2.A
N$11
  Top 0.356: L1.1 16.13,26.33 17.55,24.91 U1.10
N$12
  Top 0.356: U1.9 20.95,25.55 18.52,25.55 17.83,26.25 L1.2 17.83,29.16 C1.1
N$13
  Top 0.152: C13.2 29.56,19.31 29.14,19.73 27.47,19.73 27.19,19.45 U3.28
N$15
  Top 0.152: U3.27 26.49,15.39 C16.2
N$16
  Top 0.152: R5.2 1.63,29.52 CHRG1.5
N$23
  Top 0.152: R11.2 9.81,5.47 U2.12
N$24
  Top 0.152: R12.2 9.11,4.83 U2.11
N$25
  Top 0.152: R15.2 12.1,9.26 LED3.C
N$26
  Top 0.152: LED4.C 12.53,11.55 R16.2
P0.09/NFC1  (via drill 0.35)
  Top 0.152: v27.73,20.75 28.01,21.03 28.05,21.03 28.41,21.4 U1.22 | v22.3,15.08 22.3,14.03 C6.1
  Bottom 0.152: v22.3,15.08 22.62,15.08 26.91,20.38 27.35,20.38 v27.73,20.75
P0.10/NFC2  (via drill 0.35)
  Top 0.152: U1.23 29.34,21.83 29.34,21.17 29.54,20.97 v29.54,20.73 | v25.29,14.41 25.96,13.75 C8.1
  Bottom 0.152: v29.54,20.73 25.29,16.49 v25.29,14.41
RESET
  Top 0.152: C20.2 35.45,10.13 D3.+ 35.45,12.55 R14.1 | U1.35 31.65,30.51 33.47,28.7 33.47,25.85 33.96,25.36 35.2,25.36 35.58,25.74 DEBUG1.10 36.2,25.56 36.2,13.88 R14.1 | SW1.1 33.74,14.26 R14.1
RXD.FT
  Top 0.152: U2.4 2.76,8.64 2.56,8.84 2.56,11.06 R18.1
RXD.NRF  (via drill 0.35)
  Top 0.152: U1.21 27.71,22.76 v26.93,23.54 | v12.49,13.75 11.02,13.75 R17.2
  Bottom 0.152: v26.93,23.54 20.64,17.25 19.77,17.25 16.28,13.75 v12.49,13.75
RXLED
  Top 0.152: R15.1 9.75,8.61 8.83,8.61 U2.17
SCK  (via drill 0.35)
  Top 0.152: U3.18 20.19,16.37 v20.15,16.33 | v28.53,24.14 30.14,24.14 U1.26
  Bottom 0.152: v20.15,16.33 20.16,16.35 21.64,16.35 28.53,23.23 v28.53,24.14
SCL  (via drill 0.35)
  Top 0.152: U1.3 19.41,29.81 v19.34,29.88 | R2.1 4.28,32.69 4.7,32.27 5.54,32.27 J2.2
  Bottom 0.152: J2.2 7.39,34.12 12.85,34.12 13.74,33.22 13.74,32.58 12.36,31.2 12.36,29.82 14.73,27.45 16.91,27.45 v19.34,29.88
SDA  (via drill 0.35)
  Top 0.152: U1.2 21.01,30.82 20.19,31.64 v20.14,31.64 | R1.1 1.86,32.96 2.49,33.58 4.42,33.58 J2.1
  Bottom 0.152: J2.1 6.98,34.98 16.54,34.98 18.81,32.71 18.81,31.85 19.02,31.64 v20.14,31.64
SWCLK  (via drill 0.35)
  Top 0.152: v31.78,31.11 30.31,31.11 U1.36
  Bottom 0.152: v31.78,31.11 31.78,31.46 31.8,31.48 31.8,32.14 32.16,32.49 35.39,32.49 36.31,31.57 36.31,30.96 35.58,30.23 DEBUG1.4
SWDIO  (via drill 0.35)
  Top 0.152: U1.37 32.43,31.91 v32.41,31.89
  Bottom 0.152: v32.41,31.89 32.54,32.01 34.01,32.01 34,32 34.84,32 DEBUG1.2
SWO  (via drill 0.35)
  Top 0.152: U1.32 32.04,28.41 v32.41,28.03
  Bottom 0.152: v32.41,28.03 32.41,25.83 33.28,24.97 36.01,24.97 36.37,25.33 36.37,27.94 DEBUG1.6
TXD.FT
  Top 0.152: R17.1 8.82,13.33 8.82,10.57 U2.20
TXD.NRF  (via drill 0.35)
  Top 0.152: U1.19 26.08,21.83 26.08,21.17 25.07,20.15 v22.45,20.15 | v6.51,14.71 6.31,14.51 R18.2
  Bottom 0.152: v22.45,20.15 20.19,17.89 18.44,17.89 14.97,14.42 13.88,14.42 13.59,14.71 v6.51,14.71
TXLED  (via drill 0.35)
  Top 0.152: R16.1 9.91,11.6 v9.59,11.92 | v7.77,13.42 7.77,8.57 7.47,8.28 6.26,8.28 5.7,7.72 5.7,5.94 4.59,4.83 U2.10
  Bottom 0.152: v7.77,13.42 9.32,11.86 9.53,11.86 v9.59,11.92
USB+  (via drill 0.35)
  Top 0.152: v6.58,7.62 6.94,7.62 6.94,4.75 9.44,2.25 12.48,2.25 12.74,2.5 12.74,2.91 R12.1 12.01,3.64 C12.1
  Bottom 0.152: USB1.3 5.57,6.67 6.52,7.62 v6.58,7.62
USB-  (via drill 0.35)
  Top 0.152: R11.1 13.25,7.21 14.36,7.21 C11.2 15.72,5.85 15.72,3.13 14.27,1.68 9.01,1.68 6.31,4.39 v6.31,6.22
  Bottom 0.152: USB1.2 4.49,6.22 v6.31,6.22
V_USB  (via drill 0.35)
  Top 0.152: U2.15 8,7.37 v7.55,6.92
  Bottom 0.152: v7.55,6.92 7.38,6.75 D2.+
  Bottom 0.406: USB1.1 6.54,5.37 6.61,5.3 D2.+
VIN  (via drill 0.35)
  Top 0.152: LDO1.3 8.85,25.11 v6.61,25.11 | CHRG1.4 4.27,27.45 4.68,27.45 C5.2 5.54,28.54 R3.2
  Top 0.61: v6.83,28.29 5.54,28.29 C5.2
  Top 0.66: v6.83,28.29 8.13,28.29 C7.2 8.64,28.22 LDO1.1
  Bottom 0.61: D1.- 10.59,4.52 10.59,6.93 9.93,7.59 9.93,9.6 4.78,14.74 4.78,14.98 5.29,15.48 5.29,17.98 4.84,18.43 4.84,23.34 v6.61,25.11 6.9,25.4 6.9,28.22 v6.83,28.29
  Bottom 0.711: D2.- 7.43,2.96 8.68,2.96 8.73,3 D1.-
VLIPO  (via drill 0.35)
  Top 0.152: R8.2 4.03,19 4.03,16.09 J1.2
  Top 0.406: CHRG1.3 3.53,24.02 C10.1 v3.6,22.92 v3.59,22.91
  Bottom 0.406: v3.59,22.91 3.59,18.45 4.22,17.82 4.22,16.28 J1.2 5.14,11.98 5.76,11.98 6.67,11.06 6.67,8.8 8.26,7.22 8.26,6.11 D1.+

### Text on the board
tNames: +
bNames: +